# Altium schematic sheet RFIDSchematic.SchDoc
size A4; SheetNumber: 1; SheetTotal: 1
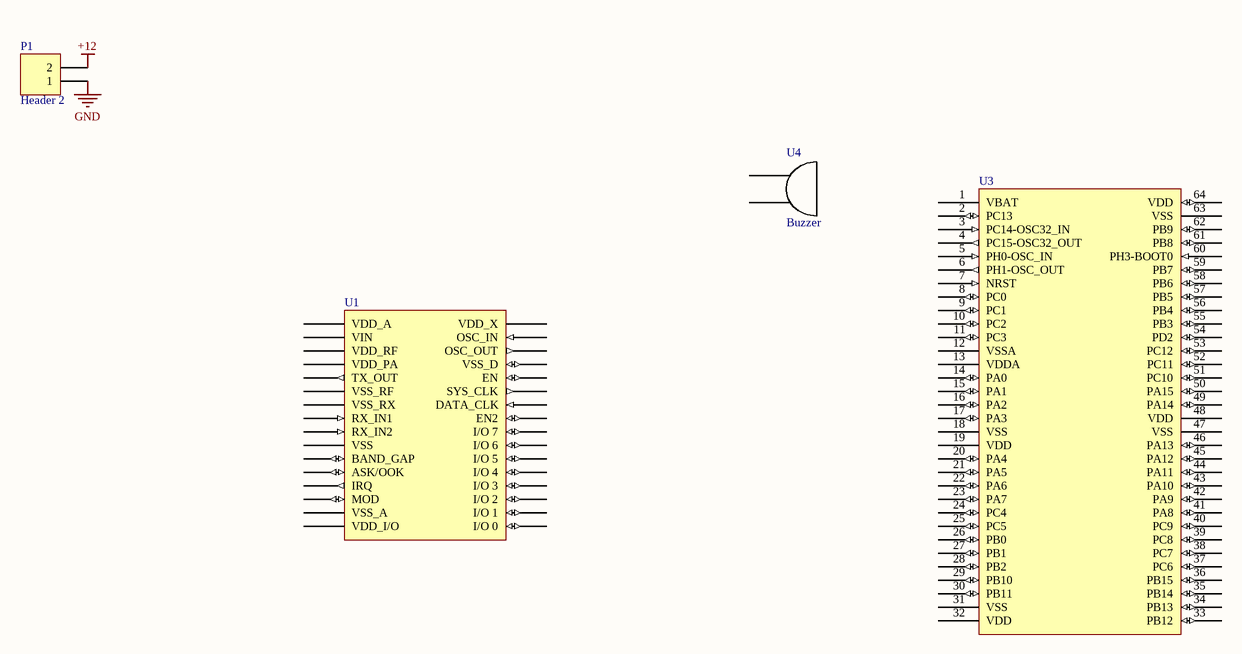
[diagram p0: RFIDSchematic.SchDoc]

## Parts
P1  Header 2  [HDR1X2]
U1  TRF7960RHBT  (value not drawn)
U3  STM32L451RCT6  [LQFP-64]  (value not drawn)
U4  Buzzer

## Nets
+12: P1.2
GND: P1.1

Not connected (* = marked no-connect by the designer): U1 ?1(VDD_A) ?2(VIN) ?3(VDD_RF) ?4(VDD_PA) ?5(TX_OUT) ?6(VSS_RF) ?7(VSS_RX) ?8(RX_IN1) ?9(RX_IN2) ?10(VSS) ?11(BAND_GAP) ?12(ASK/OOK) ?13(IRQ) ?14(MOD) ?15(VSS_A) ?16(VDD_I/O) ?17(I/O_0) ?18(I/O_1) ?19(I/O_2) ?20(I/O_3) ?21(I/O_4) ?22(I/O_5) ?23(I/O_6) ?24(I/O_7) ?25(EN2) ?26(DATA_CLK) ?27(SYS_CLK) ?28(EN) ?29(VSS_D) ?30(OSC_OUT) ?31(OSC_IN) ?32(VDD_X); U3 1(VBAT) 2(PC13) 3(PC14-OSC32_IN) 4(PC15-OSC32_OUT) 5(PH0-OSC_IN) 6(PH1-OSC_OUT) 7(NRST) 8(PC0) 9(PC1) 10(PC2) 11(PC3) 12(VSSA) 13(VDDA) 14(PA0) 15(PA1) 16(PA2) 17(PA3) 18(VSS) 19(VDD) 20(PA4) 21(PA5) 22(PA6) 23(PA7) 24(PC4) 25(PC5) 26(PB0) 27(PB1) 28(PB2) 29(PB10) 30(PB11) 31(VSS) 32(VDD) 33(PB12) 34(PB13) 35(PB14) 36(PB15) 37(PC6) 38(PC7) 39(PC8) 40(PC9) 41(PA8) 42(PA9) 43(PA10) 44(PA11) 45(PA12) 46(PA13) 47(VSS) 48(VDD) 49(PA14) 50(PA15) 51(PC10) 52(PC11) 53(PC12) 54(PD2) 55(PB3) 56(PB4) 57(PB5) 58(PB6) 59(PB7) 60(PH3-BOOT0) 61(PB8) 62(PB9) 63(VSS) 64(VDD); U4 4(VIN) 5(GND)

## Library data of the parts
P1 = Header 2: Header, 2-Pin; LatestRevisionDate: 17-Jul-2002; LatestRevisionNote: Re-released for DXP Platform.; Publisher: Altium Limited
U1 = TRF7960RHBT: TRF7960 Multi-Protocol Fully Integrated 13.56-MHz RFID Reader/Writer IC 32-VQFN -40 to 110
U3 = STM32L451RCT6: MCU 32-bit STM32; Manufacturer: STMicroelectronics; Manufacturer Part Number: STM32L451RCT6; RoHS: Yes; Category: Microcontrollers